# Altium schematic sheet pulsePreamplifier.SchDoc
size A4
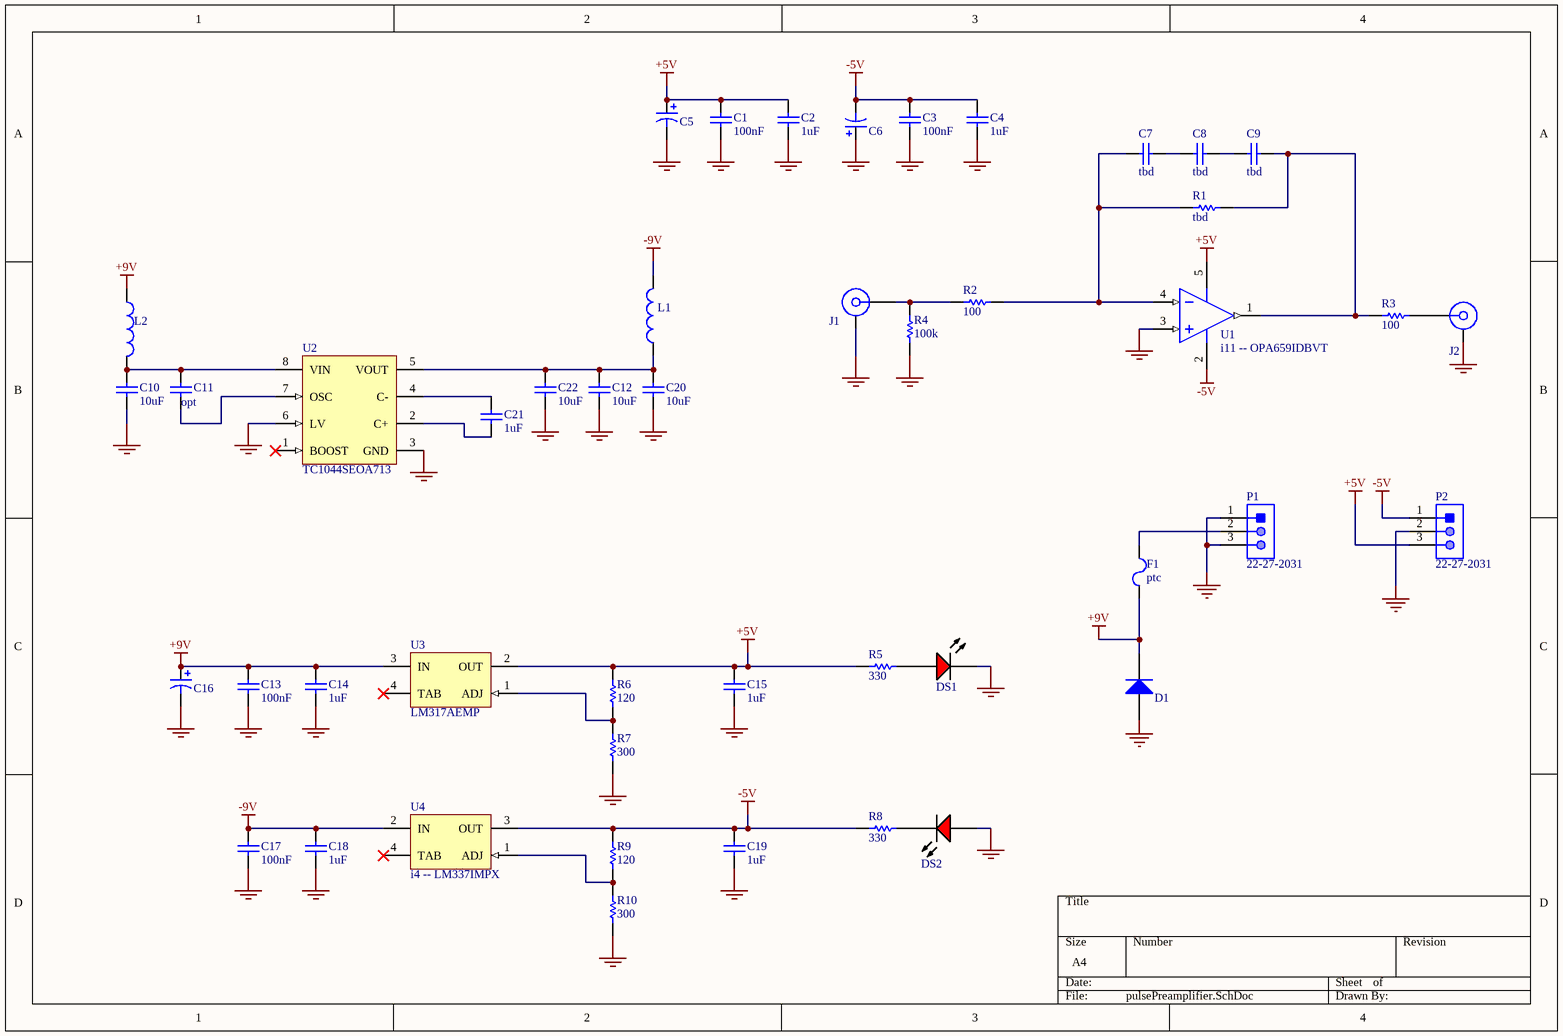
[diagram p0: pulsePreamplifier.SchDoc]

## Parts
C1  100nF  [CAPC0603(1608)100_N]
C2  1uF  [CAPC0603(1608)100_N]
C3  100nF  [CAPC0603(1608)100_N]
C4  1uF  [CAPC0603(1608)100_N]
C5  ECA-1HM470  [PNSC-ECA-1HM470]  (value not drawn)
C6  ECA-1HM470  [PNSC-ECA-1HM470]  (value not drawn)
C7  tbd  [CAPC0603(1608)100_N]
C8  tbd  [CAPC0603(1608)100_N]
C9  tbd  [CAPC0603(1608)100_N]
C10  10uF  [CAPC1206(3216)190_N]
C11  opt  [CAPC0603(1608)100_N]
C12  10uF  [CAPC1206(3216)190_N]
C13  100nF  [CAPC0603(1608)100_N]
C14  1uF  [CAPC0603(1608)100_N]
C15  1uF  [CAPC0603(1608)100_N]
C16  ECA-1HM470  [PNSC-ECA-1HM470]  (value not drawn)
C17  100nF  [CAPC0603(1608)100_N]
C18  1uF  [CAPC0603(1608)100_N]
C19  1uF  [CAPC0603(1608)100_N]
C20  10uF  [CAPC1206(3216)190_N]
C21  1uF  [CAPC0603(1608)100_N]
C22  10uF  [CAPC1206(3216)190_N]
D1  MMSD4148T3G  [ONSC-SOD123-2-425G-04_V]  (value not drawn)
DS1  TLMS1100-GS08  [VISH-TLMX1100_V]  (value not drawn)
DS2  TLMS1100-GS08  [VISH-TLMX1100_V]  (value not drawn)
F1  ptc  [LFUS-1206L012WR_V]
J1  32K145-400L5  [ROS-32K145-400L5_V]  (value not drawn)
J2  32K145-400L5  [ROS-32K145-400L5_V]  (value not drawn)
L1  FBMJ2125HM210NT  [INDC2013X105X50ML20T30]  (value not drawn)
L2  FBMJ2125HM210NT  [INDC2013X105X50ML20T30]  (value not drawn)
P1  22-27-2031  [MOLX-22-27-2031_V]
P2  22-27-2031  [MOLX-22-27-2031_V]
R1  tbd  [RESC0603(1608)_N]
R2  100  [RESC0603(1608)_N]
R3  100  [RESC0603(1608)_L]
R4  100k  [RESC0603(1608)_N]
R5  330  [RESC0603(1608)_N]
R6  120  [RESC0603(1608)_N]
R7  300  [RESC0603(1608)_N]
R8  330  [RESC0603(1608)_N]
R9  120  [RESC0603(1608)_N]
R10  300  [RESC0603(1608)_N]
U1  i11 -- OPA659IDBVT  [TI-DBV5_L]
U2  TC1044SEOA713  [SOIC-OA8_N]
U3  LM317AEMP  [DCY0004A_N]
U4  i4 -- LM337IMPX  [MP04A_N]

## Nets
+5V: C1.2 C2.2 C5.1(+) C15.2 P2.3 R5.1 R6.1 U1.5(VS+) U3.2(OUT)
+9V: C13.2 C14.2 C16.1(+) D1.1(CATHODE) F1.1 L2.1 U3.3(IN)
-5V: C3.2 C4.2 C6.2(-) C19.2 P2.1 R8.1 R9.1 U1.2(VS-) U4.3(OUT)
-9V: C17.2 C18.2 L1.2 U4.2(IN)
GND: C1.1 C2.1 C3.1 C4.1 C5.2(-) C6.1(+) C10.1 C12.1 C13.1 C14.1 C15.1 C16.2(-) C17.1 C18.1 C19.1 C20.1 C22.1 D1.2(ANODE) DS1.2(K) DS2.1(A) J1.MP J2.MP P1.1 P1.3 P2.2 R4.1 R7.2 R10.2 U1.3(IN+) U2.3(GND) U2.6(LV)
NetC7_1: C7.1 C8.2
NetC7_2: C7.2 R1.1 R2.2 U1.4(IN-)
NetC8_1: C8.1 C9.2
NetC9_1: C9.1 R1.2 R3.1 U1.1(OUT)
NetC10_2: C10.2 C11.2 L2.2 U2.8(VIN)
NetC11_1: C11.1 U2.7(OSC)
NetC12_2: C12.2 C20.2 C22.2 L1.1 U2.5(VOUT)
NetC21_1: C21.1 U2.2(C+)
NetC21_2: C21.2 U2.4(C-)
NetDS1_1: DS1.1(A) R5.2
NetDS2_2: DS2.2(K) R8.2
NetF1_2: F1.2 P1.2
NetJ1_1: J1.1 R2.1 R4.2
NetJ2_1: J2.1 R3.2
NetR6_2: R6.2 R7.1 U3.1(ADJ)
NetR9_2: R9.2 R10.1 U4.1(ADJ)

Not connected (* = marked no-connect by the designer): U2 1(BOOST)*; U3 4(TAB)*; U4 4(TAB)*

## Library data of the parts
C1 C3 C13 C17 = CMP-1035-02589-1: CAP 100nF 25V ±20% 0603 (1608 Metric) Thickness 1mm SMD; Case-EIA: 0603; Tolerance: Â±20%; Case-Metric: 1608; Value: 100nF; Max Thickness: 1 mm; Technology: SMT; Rated Voltage: 25 V
C2 C4 C7-C9 C11 C14 C15 C18 C19 C21 = CMP-1035-02589-1: CAP 1uF 25V ±20% 0603 (1608 Metric) Thickness 1mm SMD; Value: 100nF; Case-EIA: 0603; Tolerance: Â±20%; Case-Metric: 1608; Max Thickness: 1 mm; Technology: SMT; Rated Voltage: 25 V
C5 C6 C16 = CMP-1665-00013-1: CAP ALUM 47UF 50V 20% RADIAL; PartNumber: ECA-1HM470; PackageReference: ECA-1HM470; ComponentLink1Description: Datasheet; ComponentLink1URL: http://industrial.panasonic.com/cdbs/www-data/pdf/RDF0000/ABA0000C1047.pdf
C10 C12 C20 C22 = CMP-1037-04919-1: Tolerance: Â±20%; Case-Metric: 3216; Value: 4.7uF; Rated Voltage: 25 V; Case-EIA: 1206; Max Thickness: 1.9 mm; Technology: SMT
D1 = CMP-0895-00002-1: Switching Diode, 100 V, 200 mA, -55 to 150 degC, 2-Pin SOD123 (425), RoHS, Tape and Reel; Manufacturer: ON Semiconductor; CD (Max): 4 pF; IR @ VR: 75 V (Max)=50 uA; PD (Max): 425 mW; VF (Max): 1 A; Trr (Max): 4 ns; VBR (Min): 100 V; ComponentLink1URL: http://www.onsemi.com/; ComponentLink1Description: Manufacturer URL; PackageReference: SOD123-2-425G-04; PackageDescription: 2-Pin SOD123, Body 2.69 x 1.6 mm, Height 1.35 mm; ComponentLink2Description: Datasheet; Mounting Technology: Surface Mount; RoHS: TRUE; PartNumber: MMSD4148T3G; PackageVersion: Rev. 04G; DatasheetVersion: Rev. 11; Temperature Range: -55 to 150 degC; ComponentLink3Description: Package Specification; Packing: Tape and Reel; ComponentLink3URL: http://www.onsemi.com/pub_link/Collateral/425-04.PDF; ComponentLink2URL: http://www.onsemi.com/pub_link/Collateral/MMSD4148T1-D.PDF
DS1 DS2 = CMP-1666-00027-1: LED, RED, 2.1 V, -40 to 100 degC, 2-Pin SMD (0603), RoHS, Tape and Reel; Type (Capacitors): C0G; Resistance: 100000000000 Ohm; Capacitance: 12 pF; Voltage Rating: 50 V; Tolerance: 5%; Min Operating Temperature: -55degC; REACH SVHC: No SVHC; ComponentLink2Description: Datasheet; ComponentLink1URL: http://www.vishay.com/; Width: 0.8 mm; Package Quantity: 4000; PackageReference: TLMX1100; ComponentLink2URL: http://www.vishay.com/docs/83173/tlmb1100.pdf; Case/Package: 0603; Case Code (Metric): 1608; Packaging: Tape and Reel; Pins: 2; ComponentLink1Description: Manufacturer URL; Max Operating Temperature: 125degC; Height: 0.8 mm; Length: 1.6 mm; Mount: Surface Mount; PackageDescription: 2-Pin Surface Mount Device, Body 1.6 x 0.8 mm; DatasheetVersion: Rev. 2.7, 03/2016; Case Code (Imperial): 0603; Voltage Rating (DC): 50 V; RoHSCompliant: True; Radiation Hardening: No
F1 = CMP-2000-05470-1: 200mA PTC; Manufacturer: Littelfuse; Hold Current [Ih]: 0.125A; Working Voltage-Max: 30V; Trip Current: 0.29A; Operating Temp Range: -40to+85°C; Package Reference: 1206; Package Description: 2-Pin Surface Mount Device, Body 3.2 x 1.65 mm; Mounting Technology: SurfaceMount; Manufacturer URL: http://www.littelfuse.com/; Datasheet URL: https://datasheet.ciiva.com/26787/1206l012wr-26787215.pdf; Size: 1206; Datasheet Version: 04/2012
J1 J2 = CMP-0751-00004-2: SMA Right Angle Jack, Edge Mount, Up to 18 GHz, -55 to 155 degC; Manufacturer: Rosenberger; Desgin Note 2: For more information about DRC setting, please look at following webpage, http://techdocs.altium.com/display/SCRT/Design+Rule+for+Edge-Mount+Connectors; Design Note 1: Footprint in library is a generic example - only application specific footprint delivers High Performance; ComponentLink5Description: Webshop / RFQ; ComponentLink5URL: http://www.rosenberger.com/en/contact/sales/; ComponentLink3URL: http://rosenberger.de/ok/images/documents/db/32K145-400L5.pdf; DatasheetVersion: b00; ComponentLink2URL: http://rosenberger.de/ok/images/documents/db/32K145-400L5.pdf; ComponentLink4Description: Series Overview / Design Note; ComponentLink1Description: Manufacturer URL; PackageReference: 32K145-400L5; ComponentLink2Description: Datasheet; PartNumber: 32K145-400L5; PackageVersion: b00; PackageDescription: SMA Right Angle Jack, Edge Mount, 14.25 x 9.5 x 4.46 mm; ComponentLink3Description: Package Specification; ComponentLink1URL: http://www.rosenberger.de; ComponentLink4URL: http://rosenberger.de/ok/images/documents/spez/32.pdf; Mounting Technology: Surface Mount
L1 L2 = CMP-1660-00003-1: Chip Inductor, 21 Ohm, +/- 30%, 6 A, -40 to 125 degC, 0805 (2012 Metric), RoHS, Tape and Reel; Core Material: Ferrite; Current Rating: 6 A; Resistance: 4 mohm; Case\Package: 0805; Impedance: 21 Ohm; Min Operating Temperature: -40 degC; Width: 1.25 mm; PackageDescription: 2-Pin Surface Mount Device, Body 2 x 1.25 mm; Mounting Technology: Surface Mount; Package Quantity: 1; DatasheetVersion: 08/2016; Tolerance: 30%; Mount: Surface Mount; Max Operating Temperature: 125 degC; Height: 0.85 mm; ComponentLink1URL: http://www.t-yuden.com/; Case Code (Metric): 2012; ComponentLink1Description: Manufacturer URL; ComponentLink2URL: http://ds.yuden.co.jp/TYCOMPAS/ut/detail.do?productNo=FBMJ2125HM210NT&fileName=FBMJ2125HM210NT_SS&mode=specSheetDownload; Case Code (Imperial): 0805; Packaging: Tape and Reel; ComponentLink2Description: Datasheet; PackageReference: 0805; RoHSCompliant: true; Max Current Rating: 6 A; Length: 2 mm; REACH SVHC: Unknown
P1 P2 = CMP-2000-05538-1: Male Header, Pitch 2.54 mm, 1 x 3 Position, Height 11.7 mm, Tail Length 3.56 mm, -40 to 80 degC, RoHS, Bulk; Manufacturer: Molex; Voltage rating: 250V; Current rating: 4A; Package Reference: 22-27-2031; Housing material: Nylon(UL94V-0); Operating temperature: 0°Cto+75°C; Package Description: Male Header, Pitch 2.54 mm, 1 x 3 Position, Height 11.7 mm, Tail Length 3.56 mm; Package URL: http://www.molex.com/pdm_docs/sd/022272031_sd.pdf; Datasheet Version: 06/2016; Manufacturer URL: http://www.molex.com/; Mounting Technology: ThroughHole; Datasheet URL: http://www.molex.com/webdocs/datasheets/pdf/en-us/0022272031_PCB_HEADERS.pdf; Contact material: Tinplatedbrass
R1-R10 = CMP-1012-00397-1: 100R 0.1W 1% 0603 (1608 Metric)  SMD; Value: 100.00 Ohm; Case-EIA: 0603; Case-Metric: 1608; Technology: SMT; Tolerance: 1 %; Power: 0.1 W
U1 = CMP-0018-00409-1: 650 MHz Unity Gain Stable JFET Input Amplifier, 7 to 13 V, -40 to 85 degC, 5-pin SOT23 (DBV5), Green (RoHS & no Sb/Br); Manufacturer: Texas Instruments; Number of Channels: 1; THD (Fc is 1 MHz)(Typ)(dB): -78; BW @ Acl(MHz): 650; Slew Rate(Typ)(V/us): 2550; Vs(Max)(V): 13; 3rd Harmonic(dBc): 100; Sub Family: High Output Current Amplifier (>=50mA), High Speed Amplifier (>=50MHz); Vn at Flatband(Typ)(nV/rtHz): 8.9; 2nd Harmonic(dBc): 79; Vio(Max)(mV): 5; Vs(Min)(V): 7; Acl, min stable gain(V/V): 2; Io(Typ)(mA): 70; @ MHz: 10; Iq per channel(Max)(mA): 33.5; Iib(Max)(nA): 1.2; Code_JEDEC: MO-178; ComponentLink1Description: Manufacturer URL; ComponentLink3Description: Package Specification; PackageReference: DBV5; PackageVersion: 4073253-4/K, 03/2006; ComponentLink3URL: http://www.ti.com/litv/pdf/mpds018i; ComponentLink2Description: Datasheet; Mounting Technology: Surface Mount; PackageDescription: 5-Pin Plastic Small Outline, Body 1.6 x 2.9 mm, Pitch 0.95 mm; PartNumber: OPA659IDBVT; DatasheetVersion: SBOS342B; ComponentLink1URL: http://www.ti.com/; Eco-Plan: Green (RoHS & no Sb/Br); ComponentLink2URL: http://www.ti.com/general/docs/lit/getliterature.tsp?genericPartNumber=OPA659&fileType=pdf
U2 = CMP-0132-00045-1: Charge Pump DC-TO-DC Voltage Converter, 8-Pin SOIC 150mil, Industrial Temperature, Tape and Reel; Code_IPC: SOIC127P600-8; DatasheetVersion: revA, Oct-2002; PackageDescription: 8-Lead Plastic Small Outline (OA) - Narrow, 3.90mm Body [SOIC]; PackageVersion: revBB, Aug-2009; PackageReference: SOIC-OA8
U3 = CMP-0062-01709-3: 3-Terminal Adjustable Regulator, 4-pin SOT-223; Manufacturer: Texas Instruments; PowerWise: N; CompType: LDO IC; PackageTopMarking: XYTT*N07A; Code_JEDEC: TO-261-AA; PackageReference: DCY0004A; ComponentLink1URL: http://www.ti.com/general/docs/lit/getliterature.tsp?genericPartNumber=LM317-N&fileType=pdf; Code_IPC: SOT223-4; PinCount: 4; ComponentLink1Description: Datasheet URL; PackageDescription: Molded SOT-223, 6.50 x 3.56 x 1.6mm Body, 4 Lead, 2.3mm Pitch; RoHS: N
U4 = CMP-0062-01833-1: 3-Terminal Adjustable Negative Regulator, 4-pin SOT-223; Manufacturer: National Semiconductor; PackageTopMarking: XYTT*N02A; PowerWise: N; CompType: LDO IC; PinCount: 4; PackageDescription: Molded SOT-223, 6.50 x 3.56 x 1.6mm Body, 4 Lead, 2.3mm Pitch; DatasheetVersion: Nov-2004; Code_JEDEC: TO-261-AA; PackageVersion: revB, Apr-2003; PackageReference: MP04A; Code_IPC: SOT223-4; RoHS: N